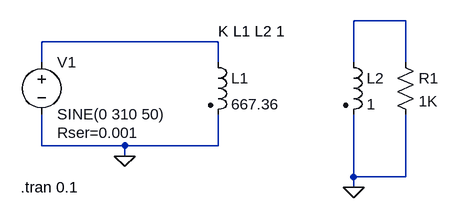
[diagram p0: schematic 1_1.asc]
1_1.asc, the LTspice schematic file:
Version 4
SHEET 1 1160 680
WIRE 496 48 416 48
WIRE 208 80 -64 80
WIRE -64 112 -64 80
WIRE 208 112 208 80
WIRE 416 112 416 48
WIRE 496 112 496 48
WIRE -64 240 -64 192
WIRE 64 240 -64 240
WIRE 208 240 208 192
WIRE 208 240 64 240
WIRE 64 256 64 240
WIRE 416 288 416 192
WIRE 496 288 496 192
WIRE 496 288 416 288
WIRE 416 304 416 288
FLAG 64 256 0
FLAG 416 304 0
SYMBOL voltage -64 96 R0
WINDOW 123 0 0 Left 2
WINDOW 39 24 124 Left 2
SYMATTR SpiceLine Rser=0.001
SYMATTR InstName V1
SYMATTR Value SINE(0 310 50)
SYMBOL ind2 192 96 R0
SYMATTR InstName L1
SYMATTR Value 667.36
SYMATTR Type ind
SYMBOL res 480 96 R0
SYMATTR InstName R1
SYMATTR Value 1K
SYMBOL ind2 400 96 R0
SYMATTR InstName L2
SYMATTR Value 1
SYMATTR Type ind
TEXT 208 64 Left 2 !K L1 L2 1
TEXT -96 304 Left 2 !.tran 0.1

The netlist it stands for:
* 1_1.asc
V1 N002 0 SINE(0 310 50) Rser=0.001
L1 N002 0 667.36
R1 N001 0 1K
L2 N001 0 1
K L1 L2 1
.tran 0.1
.backanno
.end